# EAGLE design meped (EAGLE 9.0.0)
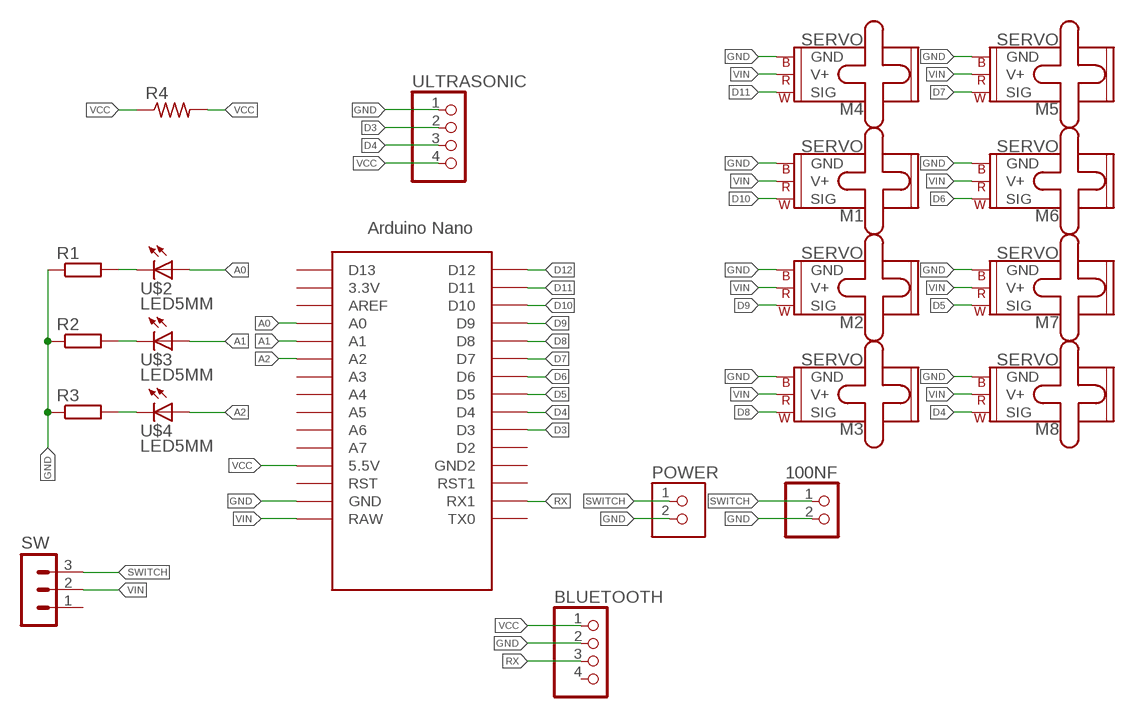
[diagram p0: schematic, sheet 1]

## Parts
100NF  PINHD-1X2  [1X02]
BLUETOOTH  PINHD-1X4  [1X04]
M1  SERVO  [1X03]
M2  SERVO  [1X03]
M3  SERVO  [1X03]
M4  SERVO  [1X03]
M5  SERVO  [1X03]
M6  SERVO  [1X03]
M7  SERVO  [1X03]
M8  SERVO  [1X03]
POWER  TERM-1X02-ADAFRUIT  [3.5MMTERM]
R1  R-EU_0204/5  [0204/5]
R2  R-EU_0204/5  [0204/5]
R3  R-EU_0204/5  [0204/5]
R4  RES-US1206FAB  [R1206FAB]
SW  MA03-1  [MA03-1]
U$1  NANO  [NANO]
U$2  LED5MM  [5MM]
U$3  LED5MM  [5MM]
U$4  LED5MM  [5MM]
ULTRASONIC  PINHD-1X4  [1X04]

## Nets
A0: U$1.A0 U$2.IN(A)
A1: U$1.A1 U$3.IN(A)
A2: U$1.A2 U$4.IN(A)
D3: U$1.D3 ULTRASONIC.2
D4: M8.1(SIG) U$1.D4 ULTRASONIC.3
D5: M7.1(SIG) U$1.D5
D6: M6.1(SIG) U$1.D6
D7: M5.1(SIG) U$1.D7
D8: M3.1(SIG) U$1.D8
D9: M2.1(SIG) U$1.D9
D10: M1.1(SIG) U$1.D10
D11: M4.1(SIG) U$1.D11
D12: U$1.D12
GND: 100NF.2 BLUETOOTH.2 M1.3(GND) M2.3(GND) M3.3(GND) M4.3(GND) M5.3(GND) M6.3(GND) M7.3(GND) M8.3(GND) POWER.2 R1.1 R2.1 R3.1 U$1.GND ULTRASONIC.1
N$1: R1.2 U$2.OUT(C)
N$2: R2.2 U$3.OUT(C)
N$3: R3.2 U$4.OUT(C)
RX: BLUETOOTH.3 U$1.RX1
SWITCH: 100NF.1 POWER.1 SW.3
VCC: BLUETOOTH.1 R4.1 R4.2 U$1.5V(5.5V) ULTRASONIC.4
VIN: M1.2(V+) M2.2(V+) M3.2(V+) M4.2(V+) M5.2(V+) M6.2(V+) M7.2(V+) M8.2(V+) SW.2 U$1.RAW
Unconnected: BLUETOOTH.4 SW.1 U$1.3.3V U$1.A3 U$1.A4 U$1.A5 U$1.A6 U$1.A7 U$1.AREF U$1.D2 U$1.D13 U$1.GND1(GND2) U$1.ICSP1 U$1.ICSP2 U$1.ICSP3 U$1.ICSP4 U$1.ICSP5 U$1.ICSP6 U$1.RST U$1.RST1 U$1.TX0

## Library data of the parts
100NF = pinhead:PINHD-1X2: PIN HEADER
BLUETOOTH ULTRASONIC = pinhead:PINHD-1X4: PIN HEADER
M1-M8 = SparkFun-Electromechanical:SERVO: Servo Motor 3-pin connector for a standard servo motor (voltage supply, ground, and control signal.) SparkFun Products Servo - Generic (Sub-Micro Size) <https://www.sparkfun.com/products/9065> (ROB-09065) Servo - Generic High Torque Continuous Rotation (Standard Size) <https://www.sparkfun.com/products/9347> (ROB-09347) Servo - Generic High Torque (Standard Size) <https://www.sparkfun.com/products/11965> (ROB-11965)
POWER = fab:TERM-1X02: 3.5mm terminal block, 2 positions ED555-2DS as found in the fablab inventory. Stolen from Adafruit <http://www.ladyada.net/library/pcb/eaglelibrary.html>, adapted by Zaerc.
R1-R3 = resistor:R-EU_: RESISTOR, European symbol
R4 = fab:RES-US: Resistor (US Symbol) Variants with postfix FAB are widened to allow the routing of internal traces
SW = con-lstb:MA03-1: PIN HEADER; OC_FARNELL: unknown; OC_NEWARK: unknown
U$1 = Arduino-clone:NANO: Arduino Nano
U$2-U$4 = fab:LED: LED

## Board
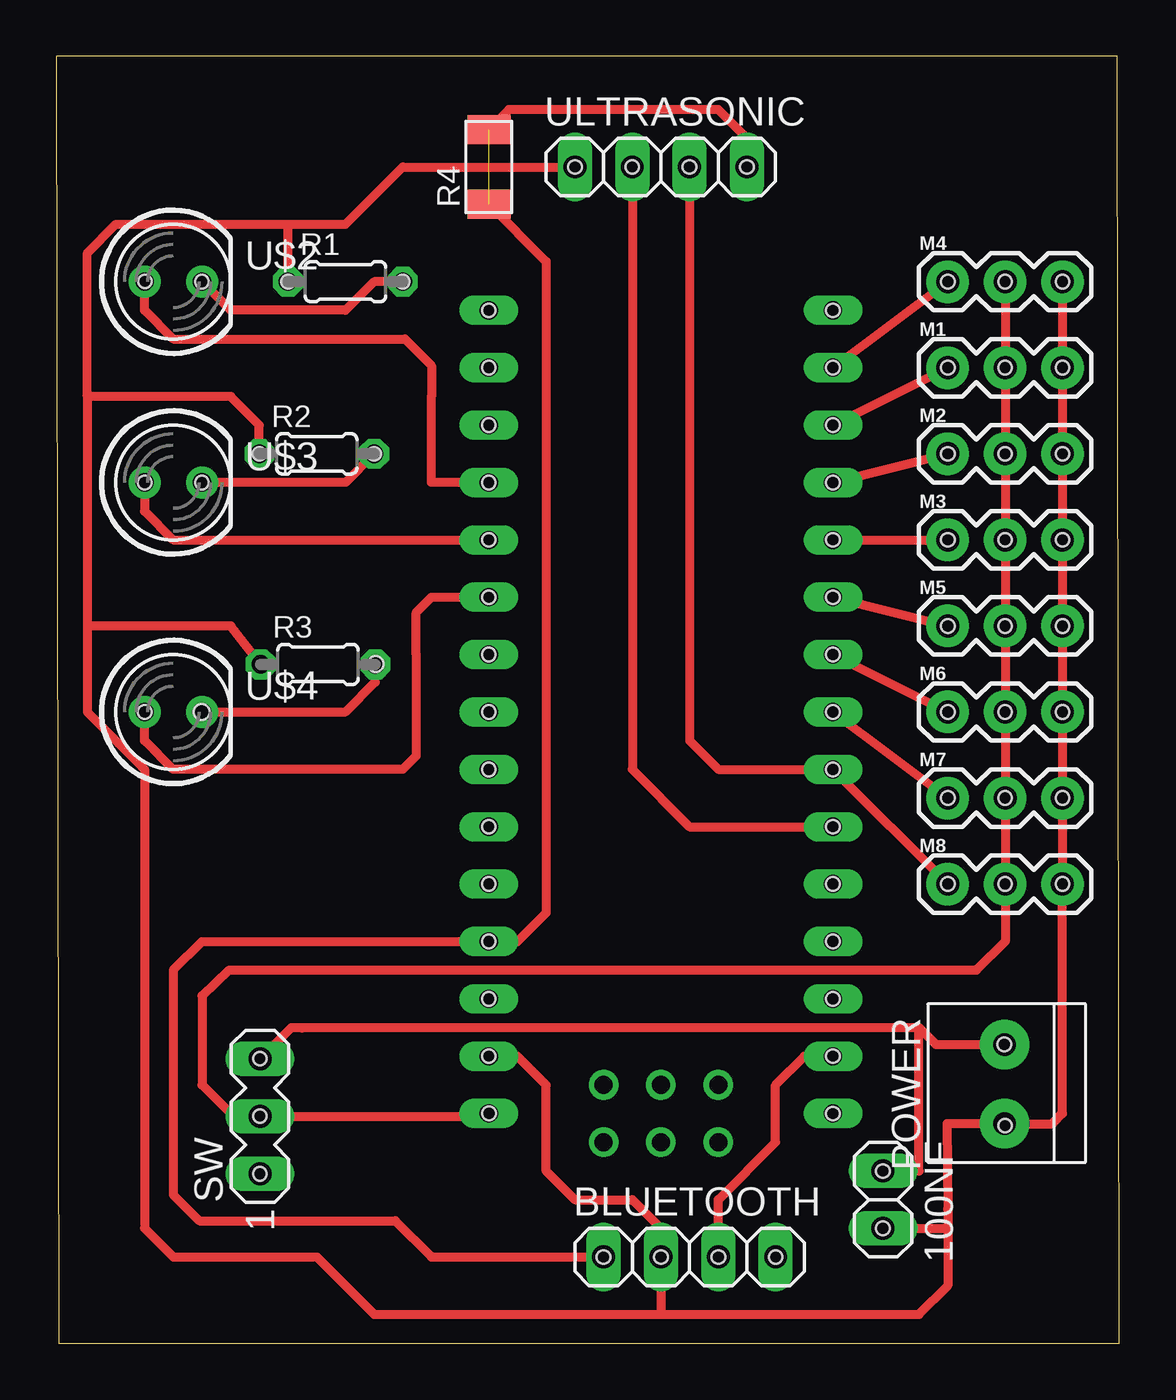
[diagram p1: board, top side]

Size 47.06 x 56.96 mm. Coordinates in mm from the lower left corner, seen from the top.
Outline: 0.09,0 47.06,0 46.97,56.96 0,56.96 0.09,0
Copper layers (1*16): Top 0.035mm / dielectric 1.5mm / Bottom 0.035mm
Design rules "default *": minimum track width 6mil, minimum drill 0.35mm, track to track 16mil, track to pad 16mil, pad to pad 16mil, via to via 16mil, smd to smd 16mil, copper to edge 40mil, drill to drill 16mil, minimum pad ring 10mil, minimum via ring 8mil, stop-mask expansion 4mil, vias tented up to drill 0mil, thermal gap 10mil
Holes 0.6 mm at 15.33,46.99 6.44,46.99 10.25,46.99 3.92,47 14.06,39.37 6.44,38.1 3.9,38.1 8.98,39.37 19.14,45.72 19.14,43.18 19.14,40.64 19.14,38.1 19.14,35.56 19.14,33.02 19.14,30.48 19.14,27.94 19.14,25.4 19.14,22.86 19.14,20.32 19.14,15.24 34.38,22.86 19.14,17.78 9.01,10.05 9.01,7.49 9.01,12.59 3.9,27.94 34.38,10.16 19.14,12.7 34.38,20.32 34.38,17.78 39.46,20.32 34.38,27.94 34.38,30.48 34.38,33.02 34.38,35.56 34.38,38.1 34.38,40.64 34.38,43.18 34.38,45.72 28.03,52.07 30.57,52.07 25.49,52.07 22.96,52.07 42,46.99 44.54,46.99 39.46,46.99 39.46,43.18 39.46,39.37 39.46,35.56 39.46,31.75 39.46,27.94 39.46,24.13 44.54,20.32 44.54,24.13 44.54,27.94 44.54,31.75 44.54,35.56 44.54,39.37 44.54,43.18 42,43.18 42,39.37 42,35.56 42,31.75 42,27.94 42,24.13 42,20.32 31.84,3.81 29.3,3.81 26.76,3.81 24.22,3.81 41.97,13.23 42,9.63 34.38,15.24 34.38,12.7 34.38,25.4 36.6,7.62 36.6,5.08 19.15,10.16
Holes 0.35 mm at 9.03,30.05
Holes 0.7 mm at 14.12,30.07 6.43,27.94

### Footprints (pad centres in the part's own frame; a part is rotated, then mirrored left to right if it is on the bottom)
1X02 = drill 1.016 long: 1 -1.27,0; 2 1.27,0
1X04 = drill 1.016 long: 1 -3.81,0; 2 -1.27,0; 3 1.27,0; 4 3.81,0
1X03 = drill 1.016 pad 1.88: 1 0,0; 2 2.54,0; 3 5.08,0
3.5MMTERM = drill 1 pad 2.184: 1 1.8,0; 2 -1.7,0
0204/5 = drill 0.813 octagon: 1 -2.54,0; 2 2.54,0
R1206FAB = smd 1.27 x 1.905: 1 -1.651,0; 2 1.651,0
MA03-1 = drill 1.016 long: 1 -2.54,0; 2 0,0; 3 2.54,0
NANO = drill 0.8 long: 3.3V -10.16,24.13; 5V -10.16,-1.27; A0 -10.16,19.05; A1 -10.16,16.51; A2 -10.16,13.97; A3 -10.16,11.43; A4 -10.16,8.89; A5 -10.16,6.35; A6 -10.16,3.81; A7 -10.16,1.27; AREF -10.16,21.59; D2 5.08,1.27; D3 5.08,3.81; D4 5.08,6.35; D5 5.08,8.89; D6 5.08,11.43; D7 5.08,13.97; D8 5.08,16.51; D9 5.08,19.05; D10 5.08,21.59; D11 5.08,24.13; D12 5.08,26.67; D13 -10.16,26.67; GND -10.16,-6.35; GND1 5.08,-1.27; RAW -10.16,-8.89; RST -10.16,-3.81; RST1 5.08,-3.81; RX1 5.08,-6.35; TX0 5.08,-8.89 | drill 0.8: ICSP1 -5.08,-10.16; ICSP2 -5.08,-7.62; ICSP3 -2.54,-10.16; ICSP4 -2.54,-7.62; ICSP5 0,-10.16; ICSP6 0,-7.62
5MM = drill 0.813 pad 1.422: IN -1.27,0; OUT 1.27,0

### Placement (x,y rotation side)
100NF  36.6,6.35 270 top
BLUETOOTH  28.03,3.81 0 top
M1  39.46,43.18 0 top
M2  39.46,39.37 0 top
M3  39.46,35.56 0 top
M4  39.46,46.99 0 top
M5  39.46,31.75 0 top
M6  39.46,27.94 0 top
M7  39.46,24.13 0 top
M8  39.46,20.32 0 top
POWER  41.97,11.41 90 top
R1  12.79,46.99 0 top
R2  11.52,39.37 0 top
R3  11.58,30.05 0 top
R4  19.14,52.07 90 top
SW  9.02,10.04 90 top
U$1  29.3,19.05 0 top
U$2  5.17,46.99 0 top
U$3  5.17,38.1 0 top
U$4  5.17,27.94 0 top
ULTRASONIC  26.76,52.07 0 top

### Tracks (layer width: path | path; a pad name or v marks a point on that pad's centre or on a via)
A0
  Top 0.406: U$1.A0 16.6,38.1 16.6,41.91 16.6,43.27 16.61,43.27 15.43,44.45 5.17,44.45 3.9,45.72 U$2.IN
A1
  Top 0.406: U$1.A1 5.17,35.56 3.9,36.83 U$3.IN
A2
  Top 0.406: 15.93,30.49 15.92,29.92 | U$4.IN 3.9,26.67 5.17,25.4 15.33,25.4 15.93,26 15.93,30.49 | 15.93,30.49 15.93,32.35 16.6,33.02 U$1.A2
D3
  Top 0.406: ULTRASONIC.2 25.49,25.4 28.03,22.86 U$1.D3
D4
  Top 0.406: M8.1 U$1.D4 29.3,25.4 28.03,26.67 ULTRASONIC.3
D5
  Top 0.406: U$1.D5 M7.1
D6
  Top 0.406: U$1.D6 M6.1
D7
  Top 0.406: U$1.D7 M5.1
D8
  Top 0.406: U$1.D8 M3.1
D9
  Top 0.406: U$1.D9 M2.1
D10
  Top 0.406: U$1.D10 M1.1
D11
  Top 0.406: U$1.D11 M4.1
GND
  Top 0.406: 1.36,41.91 1.36,31.75 | 1.36,41.91 7.71,41.91 8.98,40.64 R2.1 | R3.1 7.71,31.75 1.36,31.75 | M4.3 M1.3 M2.3 M3.3 M5.3 M6.3 M7.3 M8.3 44.54,10.16 44.09,9.71 POWER.2 39.43,9.71 39.46,5.93 39.46,5.05 | BLUETOOTH.2 26.76,5.08 25.49,6.35 22.95,6.35 21.68,7.62 21.68,11.43 20.41,12.7 U$1.GND | 26.76,2.54 BLUETOOTH.2 | 39.46,5.05 39.46,2.54 38.19,1.27 26.76,1.27 | BLUETOOTH.2 26.76,1.27 | ULTRASONIC.1 15.33,52.07 12.79,49.53 10.25,49.53 | 1.36,41.91 1.36,48.26 2.63,49.53 10.25,49.53 | R1.1 10.25,49.53 | 1.36,31.75 1.36,27.94 3.9,25.4 3.9,5.08 5.17,3.81 11.52,3.81 14.06,1.27 26.76,1.27 | 100NF.2 39.43,5.08 39.46,5.05
N$1
  Top 0.406: R1.2 14.06,46.99 12.79,45.72 7.71,45.72 U$2.OUT
N$2
  Top 0.406: R2.2 12.79,38.1 U$3.OUT
N$3
  Top 0.406: U$4.OUT 12.79,27.94 14.12,29.26 R3.2
RX
  Top 0.406: BLUETOOTH.3 29.3,6.35 31.84,8.89 31.84,11.43 33.11,12.7 U$1.RX1
SWITCH
  Top 0.406: POWER.1 38.95,13.21 38.19,13.97 | 10.89,13.97 38.19,13.97 | 10.87,13.95 10.89,13.97 | SW.3 10.41,13.97 10.89,13.97 | 100NF.1 | 100NF.1 38.19,7.62 38.19,13.97
VCC  (1 unrouted)
  Top 0.406: 24.22,5.08 BLUETOOTH.1 16.6,3.81 15,5.42 6.32,5.42 5.17,6.57 5.17,16.51 6.44,17.78 U$1.5V 20.41,17.78 21.68,19.05 21.68,47.88 R4.1 | ULTRASONIC.4 30.57,53.34 29.3,54.61 20.03,54.61 R4.2
VIN
  Top 0.406: M4.2 M1.2 M2.2 M3.2 M5.2 M6.2 M7.2 M8.2 42,17.78 40.73,16.51 7.65,16.51 6.44,15.37 6.44,11.43 7.83,10.05 | 7.83,10.05 7.83,9.98 | 7.92,10.14 7.83,10.05 | 7.83,10.05 7.84,10.04 SW.2 19.02,10.04 U$1.RAW